# EAGLE design IO_Bottom_Board (EAGLE 9.6.2)
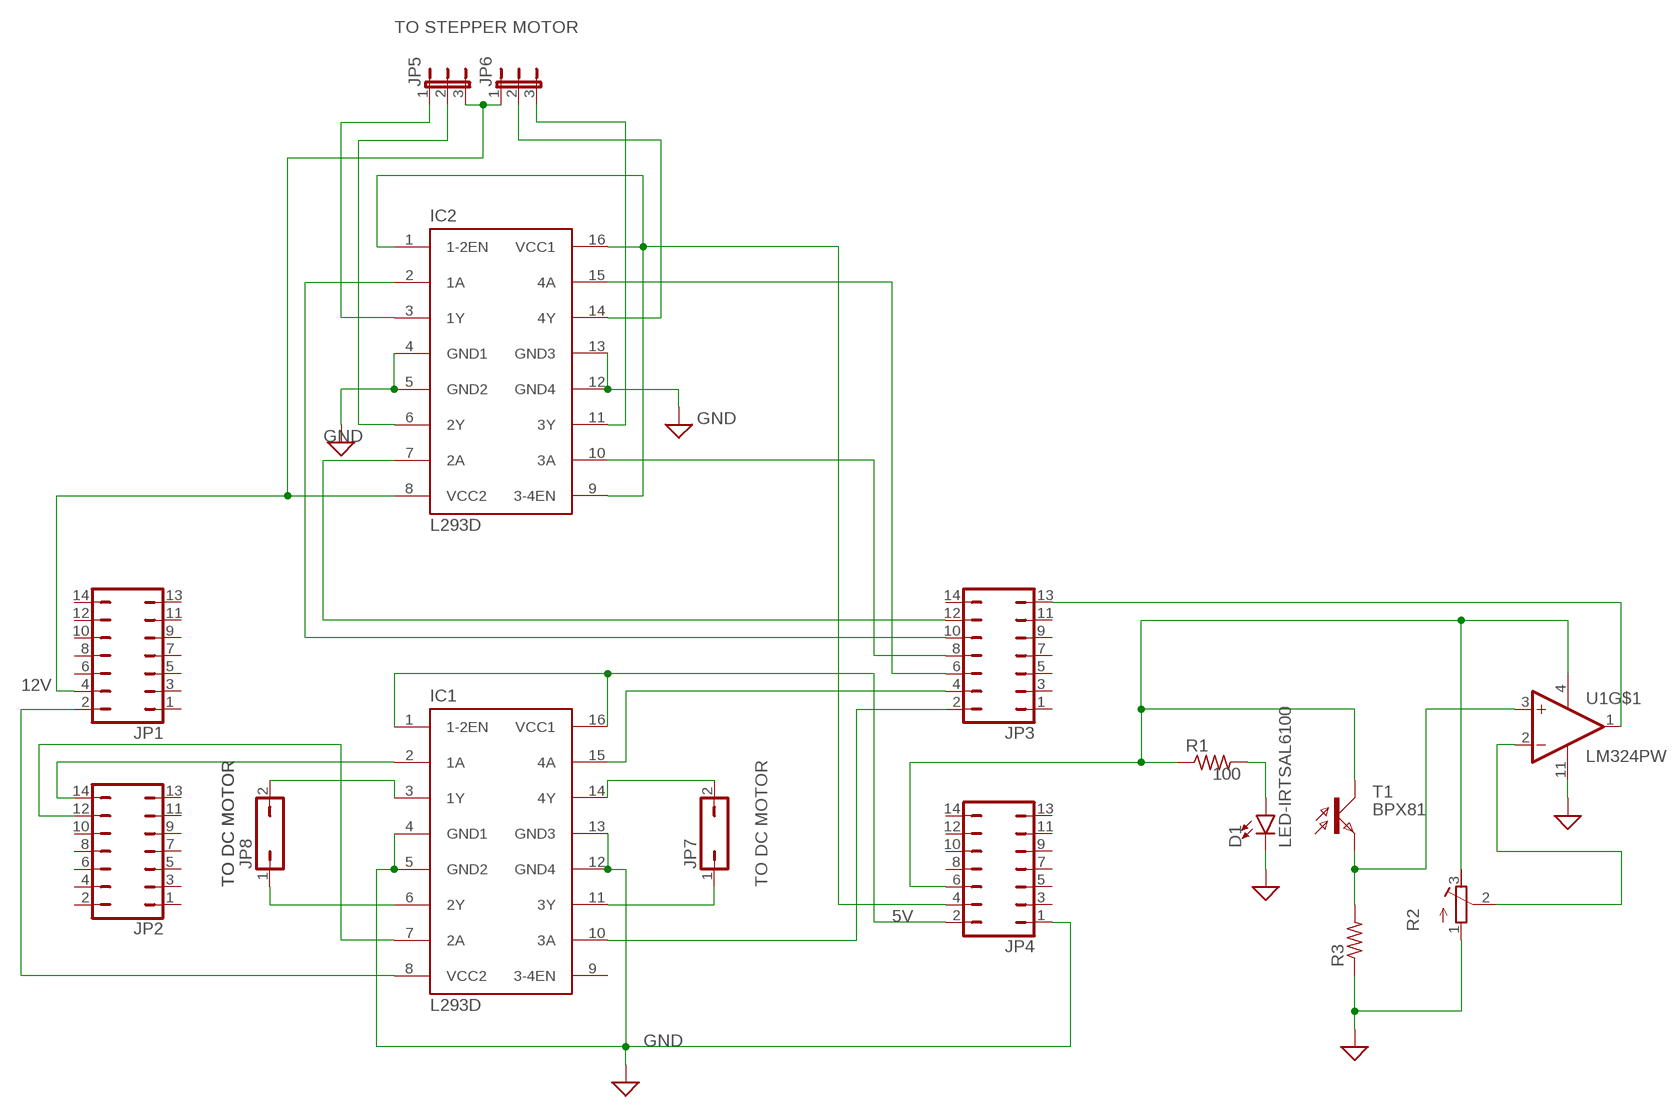
[diagram p0: schematic, sheet 1]

## Parts
D1  LED-IRTSAL6100  [LED_5MM]
IC1  L293D  [DIL16]
IC2  L293D  [DIL16]
JP1  JP7Q  [JP7Q]
JP2  JP7Q  [JP7Q]
JP3  JP7Q  [JP7Q]
JP4  JP7Q  [JP7Q]
JP5  JP2E  [JP2]
JP6  JP2E  [JP2]
JP7  JP1Q  [JP1]
JP8  JP1Q  [JP1]
R1  R-US_0204/2V  [0204V]
R2  R-TRIMM3214W  [RTRIM3214W]
R3  R-US_0204/2V  [0204V]
T1  BPX81  [BPX81]
U1  LM324PW  [SOP65P640X120-14N]

## Nets
5V: IC1.8(VCC2) JP1.2
GND: D1.K(C) IC1.4(GND1) IC1.5(GND2) IC1.12(GND4) IC1.13(GND3) IC2.4(GND1) IC2.5(GND2) IC2.12(GND4) IC2.13(GND3) JP4.1 R2.1(A) R3.1 U1.11(GND) ; supply symbol labelled SUP
N$1: IC1.3(1Y) JP8.2
N$2: IC1.6(2Y) JP8.1
N$3: IC1.11(3Y) JP7.1
N$4: IC1.14(4Y) JP7.2
N$5: IC1.2(1A) JP2.14
N$6: IC1.7(2A) JP2.12
N$7: IC1.1(1-2EN) IC1.16(VCC1) JP4.2
N$8: IC1.15(4A) JP3.4
N$9: IC1.10(3A) JP3.2
N$10: IC2.15(4A) JP3.6
N$11: IC2.10(3A) JP3.8
N$12: IC2.2(1A) JP3.10
N$13: IC2.7(2A) JP3.12
N$14: IC2.1(1-2EN) IC2.9(3-4EN) IC2.16(VCC1) JP4.4
N$15: IC2.6(2Y) JP5.2
N$16: IC2.3(1Y) JP5.1
N$17: IC2.11(3Y) JP6.3
N$18: IC2.8(VCC2) JP1.4 JP5.3 JP6.1
N$19: IC2.14(4Y) JP6.2
N$20: D1.A R1.2
N$21: JP3.13 U1.1(OUT1)
N$22: JP4.6 R1.1 R2.3(E) T1.C U1.4(VCC)
N$23: R3.2 T1.E U1.3(+IN1)
N$25: R2.2(S) U1.2(-IN1)
Unconnected: IC1.9(3-4EN) JP1.1 JP1.3 JP1.5 JP1.6 JP1.7 JP1.8 JP1.9 JP1.10 JP1.11 JP1.12 JP1.13 JP1.14 JP2.1 JP2.2 JP2.3 JP2.4 JP2.5 JP2.6 JP2.7 JP2.8 JP2.9 JP2.10 JP2.11 JP2.13 JP3.1 JP3.3 JP3.5 JP3.7 JP3.9 JP3.11 JP3.14 JP4.3 JP4.5 JP4.7 JP4.8 JP4.9 JP4.10 JP4.11 JP4.12 JP4.13 JP4.14 U1.5(+IN2) U1.6(-IN2) U1.7(OUT2) U1.8(OUT3) U1.9(-IN3) U1.10(+IN3) U1.12(+IN4) U1.13(-IN4) U1.14(OUT4)

## Notes on the sheet
- TO STEPPER MOTOR
- GND
- GND
- 12V
- 100
- TO DC MOTOR | TO DC MOTOR | TO DC MOTOR
- GND

## Library data of the parts
D1 = SparkFun-LED:LED-IR: Infrared LED (IR) Wavelength: 940nm Packages: TSAL6100 LTE302 - Side firing. Check SparkFun-Sensors.lbr for the receiver SparkFun Products: ZX Distance and Gesture Sensor <[https://www.sparkfun.com/products/12780]> Infrared Emitters and Detectors <https://www.sparkfun.com/products/241>; PROD_ID: DIO-12058
IC1 IC2 = st-microelectronics:L293D: PUSH-PULL 4 CHANNEL DRIVER; MPN: L293D; OC_FARNELL: 9589619; OC_NEWARK: 56P8249
JP1-JP4 = jumper:JP7Q: JUMPER
JP5 JP6 = jumper:JP2E: JUMPER
JP7 JP8 = jumper:JP1Q: JUMPER
R1 R3 = rcl:R-US_: RESISTOR, American symbol; SPICEPREFIX: R
R2 = resistor:R-TRIMM: Trimm resistor
T1 = opto-trans-siemens:BPX81: PHOTO TRANSISTOR; OC_FARNELL: unknown; OC_NEWARK: unknown
U1 = LM324PW:LM324PW: IC OPAMP LM324/TSSOP/LM324PW TEXAS INSTRUMENT RoHS TSSOP14 Check prices <https://pricing.snapeda.com/search/part/LM324PW/?ref=eda>; AVAILABILITY: Good; DESCRIPTION: 4-Channel industry standard operational amplifier 14-TSSOP 0 to 70; MF: Texas Instruments; MP: LM324PW; PACKAGE: TSSOP-14 Texas Instruments; PRICE: None; PURCHASE-URL: https://pricing.snapeda.com/search/part/LM324PW/?ref=eda

## Board
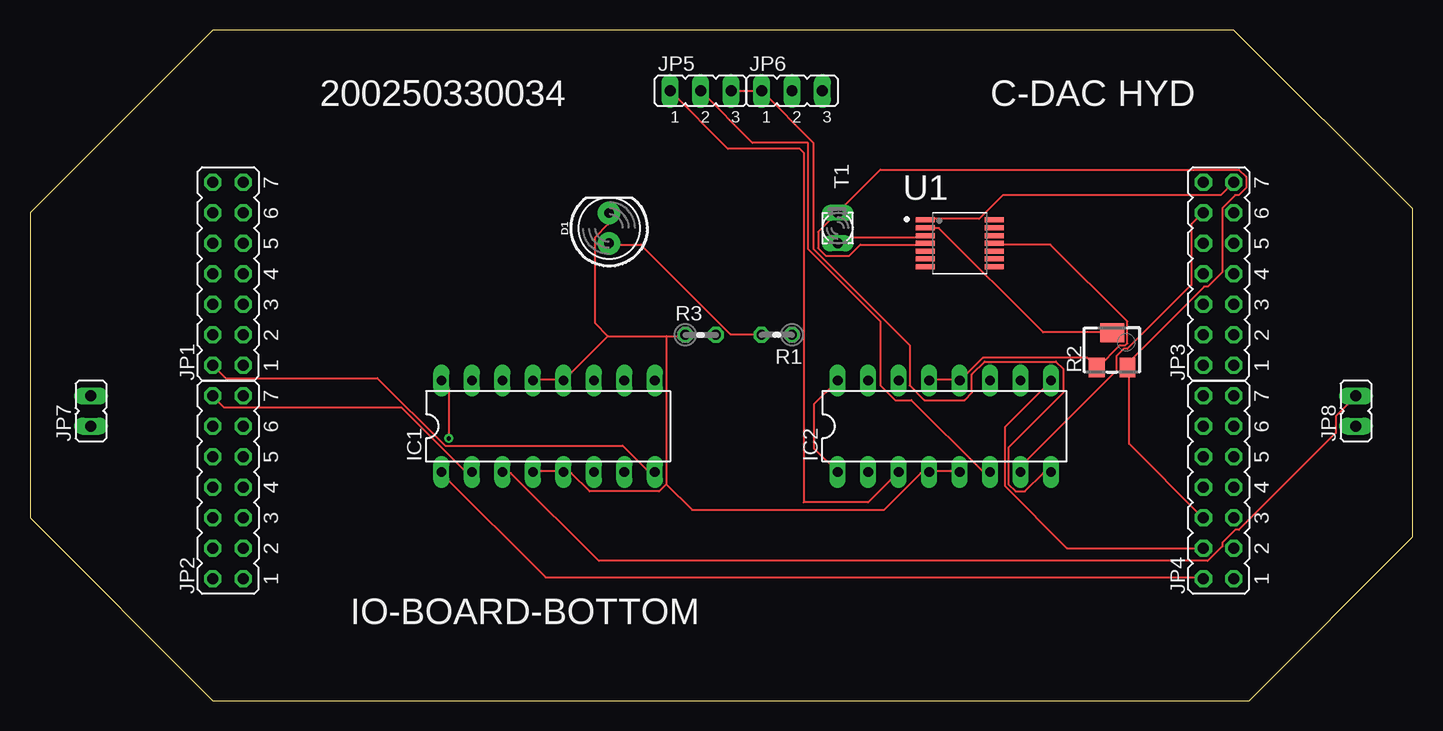
[diagram p1: board, top side]
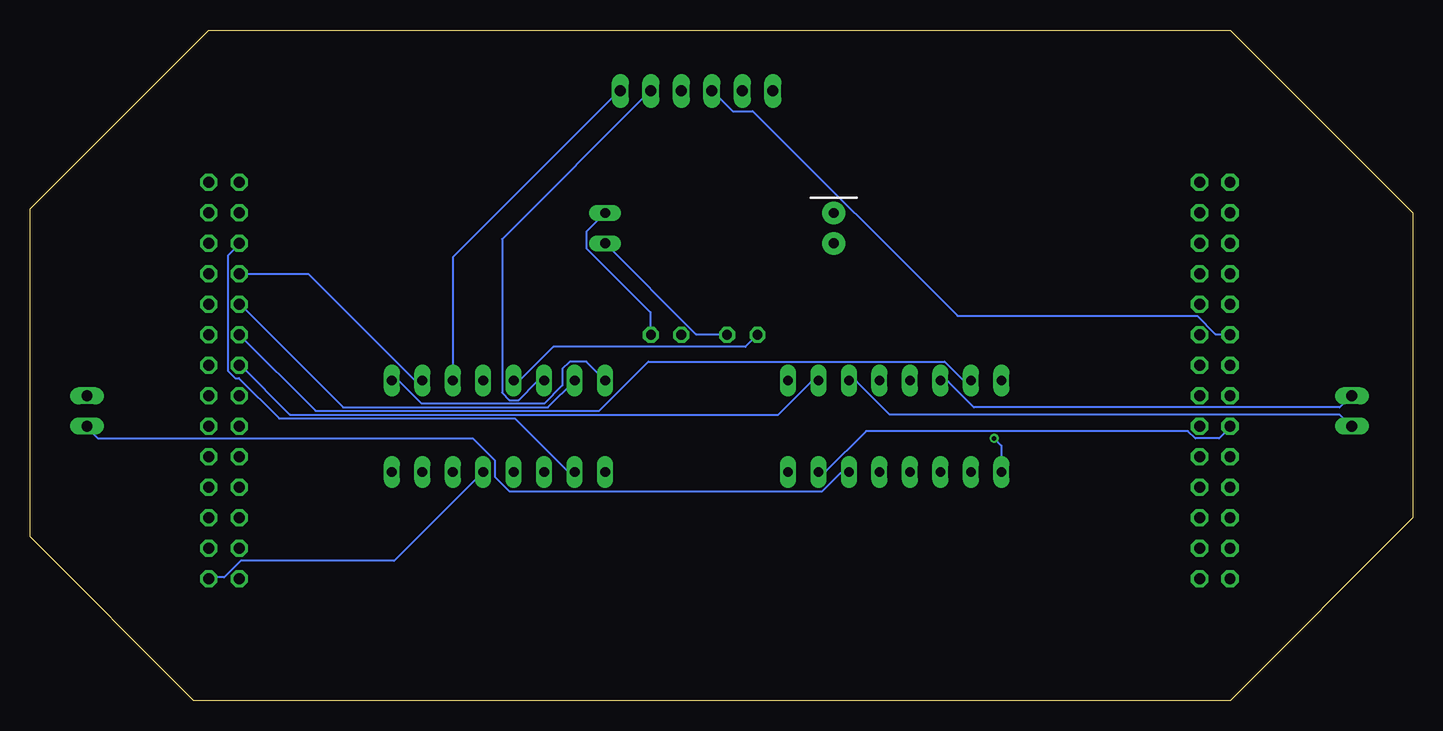
[diagram p2: board, bottom side, seen from below]

Size 115.24 x 55.88 mm. Coordinates in mm from the lower left corner, seen from the top.
Outline: 15.24,0 101.6,0 115.24,13.64 115.24,40.97 100.33,55.88 15.24,55.88 0,40.64 0,15.24 15.24,0
Copper layers (1*16): Top 0.035mm / dielectric 1.5mm / Bottom 0.035mm
Design rules "default": minimum track width 6mil, minimum drill 0.35mm, track to track 6mil, track to pad 6mil, pad to pad 6mil, via to via 6mil, smd to smd 6mil, copper to edge 40mil, drill to drill 6mil, minimum pad ring 10mil, minimum via ring 8mil, stop-mask expansion 4mil, vias tented up to drill 0mil, thermal gap 10mil

### Footprints (pad centres in the part's own frame; a part is rotated, then mirrored left to right if it is on the bottom)
LED_5MM = drill 0.813 pad 1.88: A -1.27,0; K 1.27,0
DIL16 = drill 0.813 long: 1 -8.89,-3.81; 2 -6.35,-3.81; 3 -3.81,-3.81; 4 -1.27,-3.81; 5 1.27,-3.81; 6 3.81,-3.81; 7 6.35,-3.81; 8 8.89,-3.81; 9 8.89,3.81; 10 6.35,3.81; 11 3.81,3.81; 12 1.27,3.81; 13 -1.27,3.81; 14 -3.81,3.81; 15 -6.35,3.81; 16 -8.89,3.81
JP7Q = drill 0.914 octagon: 1 -7.62,-1.27; 2 -7.62,1.27; 3 -5.08,-1.27; 4 -5.08,1.27; 5 -2.54,-1.27; 6 -2.54,1.27; 7 0,-1.27; 8 0,1.27; 9 2.54,-1.27; 10 2.54,1.27; 11 5.08,-1.27; 12 5.08,1.27; 13 7.62,-1.27; 14 7.62,1.27
JP2 = drill 0.914 long: 1 -2.54,0; 2 0,0; 3 2.54,0
JP1 = drill 0.914 long: 1 0,-1.27; 2 0,1.27
0204V = drill 0.813 octagon: 1 -1.27,0; 2 1.27,0
RTRIM3214W = smd 1.3 x 1.6: 1 -1.275,-1.45; 3 1.275,-1.45 | smd 2 x 1.6: 2 0,1.45
BPX81 = drill 0.813 long: C 1.27,0; E -1.27,0
SOP65P640X120-14N = smd 1.57 x 0.41: 1 -2.87,1.95; 2 -2.87,1.3; 3 -2.87,0.65; 4 -2.87,0; 5 -2.87,-0.65; 6 -2.87,-1.3; 7 -2.87,-1.95; 8 2.87,-1.95; 9 2.87,-1.3; 10 2.87,-0.65; 11 2.87,0; 12 2.87,0.65; 13 2.87,1.3; 14 2.87,1.95

### Placement (x,y rotation side)
D1  48.26,39.37 90 top
IC1  43.18,22.86 0 top
IC2  76.2,22.86 0 top
JP1  16.51,35.56 90 top
JP2  16.51,17.78 90 top
JP3  99.06,35.56 90 top
JP4  99.06,17.78 90 top
JP5  55.88,50.8 0 top
JP6  63.5,50.8 0 top
JP7  5.08,24.13 0 top
JP8  110.49,24.13 0 top
R1  62.23,30.48 180 top
R2  90.17,29.21 0 top
R3  55.88,30.48 0 top
T1  67.31,39.37 90 top
U1  77.47,38.1 0 top

### Tracks (layer width: path | path; a pad name or v marks a point on that pad's centre or on a via)
5V
  Top 0.152: JP1.2 16.31,26.87 28.96,26.87 34.59,21.23 49.38,21.23 51.51,19.1 51.97,19.1 IC1.8
GND
  Top 0.152: IC2.5 77.42,19.1 74.98,19.1 IC2.4 74.83,18.95 74.22,18.95 71.17,15.9 55.17,15.9 53.03,18.03 | IC2.13 74.98,26.72 77.42,26.72 IC2.12 77.57,26.72 79.4,28.55 88.09,28.55 88.85,27.79 R2.1 89,27.79 90.83,29.62 91.29,29.62 91.44,29.77 91.44,31.6 85.04,38 80.47,38 U1.11 | IC1.4 41.91,19.1 44.35,19.1 IC1.5 44.5,18.95 45.11,18.95 46.63,17.42 52.43,17.42 53.03,18.03 | IC1.13 41.91,26.72 44.35,26.72 IC1.12 48.16,30.38 | 48.16,30.38 53.03,30.38 | 53.03,30.38 54.56,30.38 R3.1 | 53.03,30.38 53.03,18.03 | 48.16,30.38 47.09,31.45 47.09,38.61 48.16,39.68 48.16,40.59 D1.K
  Bottom 0.152: IC2.5 84.89,11.63 97.69,11.63 99.06,10.26 100.28,10.26 JP4.1 | R3.1 55.63,29.46 71.63,29.46 74.37,26.72 74.83,26.72 IC2.13
N$1
  Top 0.152: IC1.3 39.47,18.95 40.08,18.95 47.4,11.63 98.15,11.63 99.36,12.85 99.36,13.16 100.43,14.22 100.74,14.22 108.81,22.3 108.81,23.67 110.49,25.35 JP8.2
N$2
  Bottom 0.152: IC1.6 47.09,18.95 47.7,18.95 49.22,17.42 75.29,17.42 76.5,18.64 76.5,20.02 78.33,21.84 109.58,21.84 110.49,22.76 JP8.1
N$3
  Bottom 0.152: IC1.11 46.94,26.57 46.33,26.57 43.59,23.83 6.1,23.83 5.18,22.91 JP7.1
N$4
  Bottom 0.152: IC1.14 39.32,26.57 38.71,26.57 36.58,24.44 6.1,24.44 5.18,25.35 JP7.2
N$5
  Top 0.152: IC1.2 36.73,19.1 36.27,19.1 30.94,24.44 16.15,24.44 15.24,25.35 JP2.14
N$6
  Bottom 0.152: IC1.7 49.53,19.1 48.92,19.1 45.57,22.45 18.75,22.45 18.14,21.84 16.15,21.84 15.24,22.76 JP2.12
N$7  (via drill 0.35)
  Top 0.152: v34.9,21.84 34.9,25.96 34.29,26.57 IC1.16 | JP4.2 97.69,10.26 42.98,10.26 34.29,18.95 IC1.1
  Bottom 0.152: IC1.1 34.29,21.23 v34.9,21.84
N$8
  Bottom 0.152: JP3.4 91.44,24.13 67.82,24.13 63.7,28.25 39.01,28.25 37.49,26.72 36.88,26.72 IC1.15
N$9
  Bottom 0.152: IC1.10 49.53,26.57 50.14,26.57 52.88,23.83 93.57,23.83 97.69,27.94 JP3.2
N$10
  Bottom 0.152: IC2.15 72.08,24.44 89.15,24.44 97.69,32.97 JP3.6
N$11
  Bottom 0.152: JP3.8 92.05,35.56 83.21,26.72 82.6,26.72 IC2.10
N$12
  Bottom 0.152: IC2.2 69.95,19.1 70.41,19.1 74.83,23.52 94.49,23.52 97.84,26.87 98.15,26.87 98.75,27.48 98.75,37.08 97.84,38 JP3.10
N$13
  Top 0.152: IC2.7 82.6,19.1 82.6,19.56 90.53,27.48 90.53,28.7 91.13,29.31 91.44,29.31 96.77,34.65 96.77,39.68 97.69,40.59 JP3.12
N$14
  Top 0.152: IC2.16 65.33,24.69 65.33,21.03 IC2.1 | JP4.4 86.41,12.7 81.23,17.88 81.23,22.76 85.04,26.57 IC2.9
  Bottom 0.152: IC2.16 68.88,28.25 70.26,28.25 70.87,27.63 70.87,26.26 72.39,24.74 82.6,24.74 84.43,26.57 85.04,26.57 IC2.9
N$15
  Top 0.152: IC2.6 80.01,19.1 79.4,19.1 73.46,25.04 72.08,25.04 70.87,26.26 70.87,31.6 64.82,37.64 64.82,46.48 60.2,46.48 JP5.2
N$16
  Top 0.152: IC2.3 69.85,16.51 64.47,16.51 64.47,45.67 64.16,45.97 58.17,45.97 JP5.1
N$17
  Bottom 0.152: IC2.11 80.01,36.93 66.14,50.8 JP6.3
N$18
  Top 0.152: IC2.8 85.04,18.95 84.43,18.95 82.91,17.42 82.14,17.42 81.53,18.03 81.53,21.08 86.11,25.65 86.11,27.63 85.5,28.25 79.55,28.25 78.49,27.18 78.49,25.65 77.88,25.04 74.52,25.04 73.3,26.26 73.3,29.62 65.28,37.64 65.28,46.48 JP6.1 JP5.3
  Bottom 0.152: JP1.4 15.24,30.53 16.46,30.53 17.98,32.05 37.95,32.05 55.02,49.12 56.69,49.12 58.37,50.8 JP5.3
N$19
  Bottom 0.152: IC2.14 72.39,26.57 73,26.57 74.52,25.04 75.29,25.04 75.89,25.65 75.89,38.46 63.55,50.8 JP6.2
N$20
  Top 0.152: R1.2 60.96,30.53 58.37,30.53 50.9,38 48.31,38 D1.A
N$21
  Top 0.152: U1.1 74.68,40.13 79.1,40.13 81.08,42.11 99.21,42.11 100.28,43.18 JP3.13
N$22
  Top 0.152: JP4.6 97.69,15.29 91.59,21.39 91.59,27.63 R2.3 91.59,27.79 91.59,28.25 97.84,34.49 98.15,34.49 99.36,35.71 99.36,41.05 100.43,42.11 100.74,42.11 101.35,42.72 101.35,43.64 100.74,44.25 70.87,44.25 67.36,40.74 T1.C 67.21,40.59 65.68,39.06 65.68,37.69 66.29,37.08 68.27,37.08 69.19,38 74.52,38 U1.4
  Bottom 0.152: T1.C 68.88,39.06 68.88,37.69 63.55,32.36 63.55,30.53 R1.1
N$23
  Top 0.152: T1.E 67.82,38.61 74.52,38.61 U1.3
  Bottom 0.152: T1.E 59.74,30.53 57.15,30.53 R3.2
N$25
  Top 0.152: U1.2 74.68,39.37 75.74,39.37 84.43,30.68 90.07,30.68 R2.2
(copper drawn outside any net)
  shapes: Top area x1

### Text on the board
tNames: 200250330034 | C-DAC HYD | IO-BOARD-BOTTOM